# Altium schematic sheet SOC_CAM.schdoc: =
size A4; Symbol: Sheet-Symbol_A4; Company: 嘉立创EDA; Version: V1.0; Page Size: A4; @Project Name: RK3568_LPD4X_120P_Core; @Page Count: 17; @Update Date: 2025-08-22; @Create Date: 2025-08-15; @Schematic Name: Schematic1; @Page No: 11; @Page Name: SOC_CAM; Device: Sheet-Symbol_A4; Border: 1; Title Block Position: 3; Width: 1170; Height: 825; Region Start: 1; X Region Count: 6; Y Region Count: 4; Blade Width: 10; @Board Name: Board1; @Create Time: 15:05:23; @Update Time: 14:34:19; Organization: ORGANIZATION; Address1: ADDRESS 1; Address2: ADDRESS 2; Address3: ADDRESS 3; Address4: ADDRESS 4; SheetNumber: 9; SheetTotal: 28
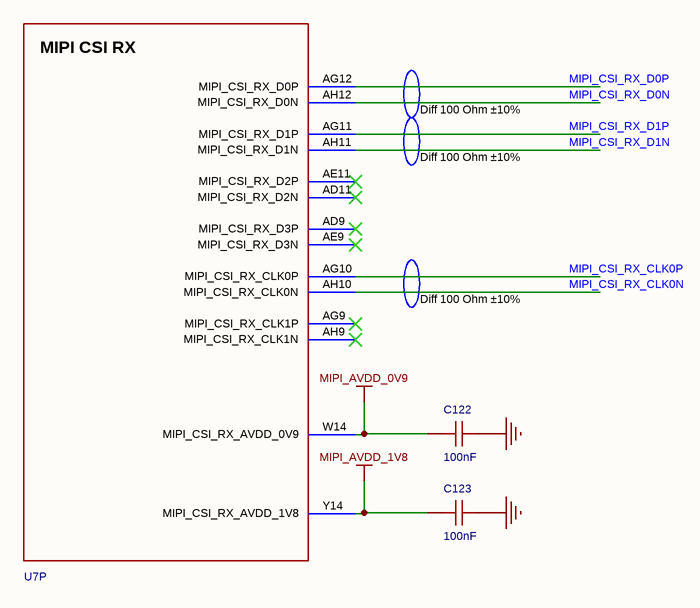
[diagram p0: SOC_CAM.schdoc]

## Parts
C122  100nF  [C0201]
C123  100nF  [C0201]
U7  RK3568  [BGA-636_L19.0-W19.0-P0.65-BL]  (value not drawn)  (part P of 23)

## Nets
GND: C122.1 C123.1
MIPI_AVDD_0V9: C122.2 U7.W14(MIPI_CSI_RX_AVDD_0V9)
MIPI_AVDD_1V8: C123.2 U7.Y14(MIPI_CSI_RX_AVDD_1V8)
MIPI_CSI_RX_CLK0N: U7.AH10(MIPI_CSI_RX_CLK0N)
MIPI_CSI_RX_CLK0P: U7.AG10(MIPI_CSI_RX_CLK0P)
MIPI_CSI_RX_D0N: U7.AH12(MIPI_CSI_RX_D0N)
MIPI_CSI_RX_D0P: U7.AG12(MIPI_CSI_RX_D0P)
MIPI_CSI_RX_D1N: U7.AH11(MIPI_CSI_RX_D1N)
MIPI_CSI_RX_D1P: U7.AG11(MIPI_CSI_RX_D1P)

Not connected (* = marked no-connect by the designer): U7 AD9(MIPI_CSI_RX_D3P)* AD11(MIPI_CSI_RX_D2N)* AE9(MIPI_CSI_RX_D3N)* AE11(MIPI_CSI_RX_D2P)* AG9(MIPI_CSI_RX_CLK1P)* AH9(MIPI_CSI_RX_CLK1N)*

## Notes on the sheet
- Diff 100 Ohm ±10%
- Drawn By :
- Checked By :
- Approved By :
- SheetNumber
- SheetTotal
- Revision :
- Time :
- Size :
- Date :
- A4
- DocumentName :
- Project :
- (in symbol RK3568, part P) MIPI CSI RX

## Library data of the parts
C122 C123 = GRM035R60J475ME15D: 容值:4.7uF;精度:±20%;额定电压:6.3V;温度系数:X5R;; Manufacturer: muRata(村田); AddInBom: yes; ModelId: e8033a7cb35143ffb28e3b81b2577ea0; ModelName: C0201_L0.6-W0.3-H0.3; ModelTransform: 23.622,11.811,0,0,0,0,0,0,0; Tolerance: ±20%; Voltage Rating: 6.3V; Temperature Coefficient: X5R; Symbol: GRM035R60J475ME15D; Value: 100nF; Device: GRM035R60J475ME15D; LCSC Part Name: 4.7uF ±20% 6.3V; ManufacturerPart: GRM035R60J475ME15D; Supplier Footprint: 0201; JLCPCB Part Class: Extended Part; Datasheet: https://item.szlcsc.com/datasheet/GRM035R60J475ME15D/313624.html; Supplier: LCSC; ConvertToPcb: yes; FootprintName: C0201
U7 = RK3568: ConvertToPcb: yes; ModelId: e6756cba1b9f43448429fdcd1d44d9d9; ModelTransform: 748.03,748.03,54.33,0,0,0,0,0,0; Symbol: RK3568; Device: RK3568; AddInBom: yes; FootprintName: BGA-636_L19.0-W19.0-P0.65-BL; ModelName: BGA-636_L19.0-W19.0-P0.65-BL